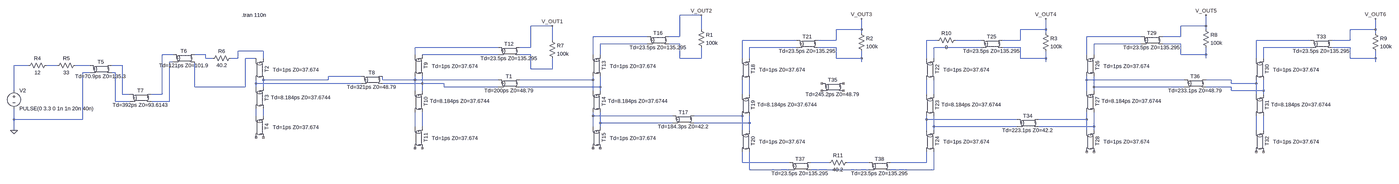
[diagram p0: schematic TDM_TransmissionLine.asc, whole sheet]
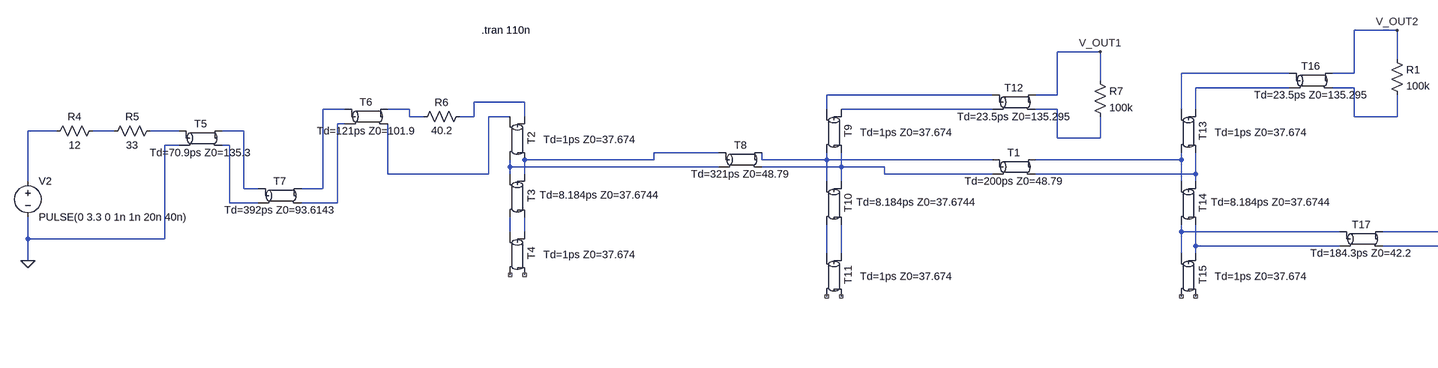
[diagram p1: schematic TDM_TransmissionLine.asc, part, row 1 of 1, column 1 of 2]
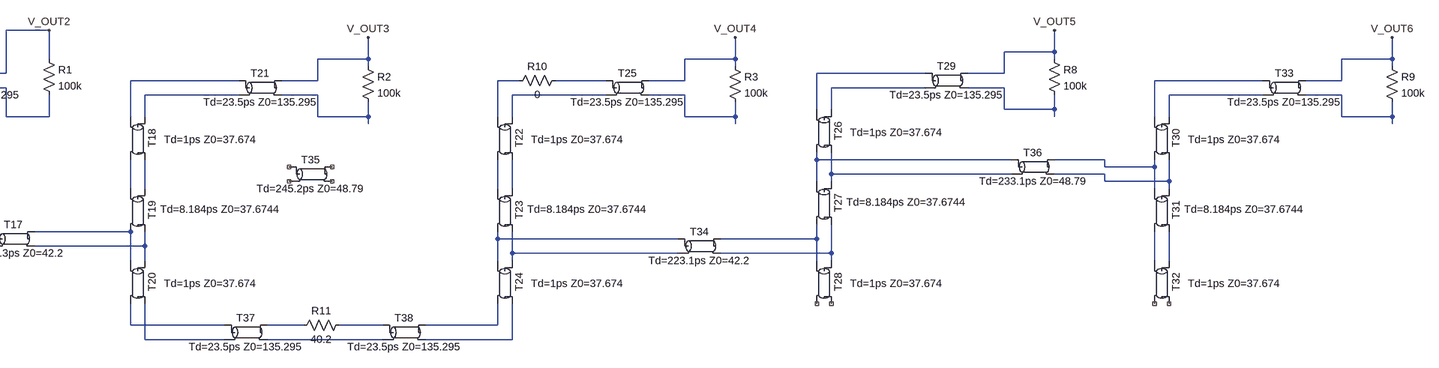
[diagram p2: schematic TDM_TransmissionLine.asc, part, row 1 of 1, column 2 of 2]
TDM_TransmissionLine.asc, the LTspice schematic file:
Version 4
SHEET 1 6036 992
WIRE 2448 272 2352 272
WIRE 1728 320 1632 320
WIRE 4864 320 4864 272
WIRE 4864 320 4752 320
WIRE 2448 336 2448 272
WIRE 3232 336 3232 288
WIRE 3232 336 3120 336
WIRE 4048 336 4048 288
WIRE 4048 336 3936 336
WIRE 4864 336 4864 320
WIRE 5648 336 5648 288
WIRE 5648 336 5536 336
WIRE 3232 352 3232 336
WIRE 4048 352 4048 336
WIRE 5648 352 5648 336
WIRE 2208 368 1968 368
WIRE 2352 368 2352 272
WIRE 2352 368 2304 368
WIRE 4576 368 4336 368
WIRE 4752 368 4752 320
WIRE 4752 368 4672 368
WIRE 1728 384 1728 320
WIRE 2944 384 2704 384
WIRE 3120 384 3120 336
WIRE 3120 384 3040 384
WIRE 3568 384 3520 384
WIRE 3760 384 3648 384
WIRE 3936 384 3936 336
WIRE 3936 384 3856 384
WIRE 5360 384 5120 384
WIRE 5536 384 5536 336
WIRE 5536 384 5456 384
WIRE 2208 400 2000 400
WIRE 2352 400 2304 400
WIRE 4576 400 4368 400
WIRE 4752 400 4672 400
WIRE 1488 416 1120 416
WIRE 1632 416 1632 320
WIRE 1632 416 1584 416
WIRE 2944 416 2736 416
WIRE 3120 416 3040 416
WIRE 3760 416 3552 416
WIRE 3936 416 3856 416
WIRE 5360 416 5152 416
WIRE 5536 416 5456 416
WIRE 448 432 336 432
WIRE 48 448 0 448
WIRE 192 448 144 448
WIRE 1120 448 1120 416
WIRE 1488 448 1152 448
WIRE 1632 448 1584 448
WIRE 1968 448 1968 368
WIRE 2000 448 2000 400
WIRE 4336 448 4336 368
WIRE 4368 448 4368 400
WIRE 4752 448 4752 400
WIRE 4864 448 4864 416
WIRE 4864 448 4752 448
WIRE 192 464 192 448
WIRE 224 464 192 464
WIRE 336 464 336 432
WIRE 336 464 304 464
WIRE 416 464 368 464
WIRE 448 464 448 432
WIRE 2352 464 2352 400
WIRE 2448 464 2448 416
WIRE 2448 464 2352 464
WIRE 2704 464 2704 384
WIRE 2736 464 2736 416
WIRE 3120 464 3120 416
WIRE 3232 464 3232 432
WIRE 3232 464 3120 464
WIRE 3520 464 3520 384
WIRE 3552 464 3552 416
WIRE 3936 464 3936 416
WIRE 4048 464 4048 432
WIRE 4048 464 3936 464
WIRE 4864 464 4864 448
WIRE 5120 464 5120 384
WIRE 5152 464 5152 416
WIRE 5536 464 5536 416
WIRE 5648 464 5648 432
WIRE 5648 464 5536 464
WIRE 48 480 32 480
WIRE 3232 480 3232 464
WIRE 4048 480 4048 464
WIRE 5648 480 5648 464
WIRE -592 496 -656 496
WIRE -464 496 -512 496
WIRE -320 496 -384 496
WIRE -176 496 -224 496
WIRE 1632 512 1632 448
WIRE 1728 512 1728 464
WIRE 1728 512 1632 512
WIRE -320 528 -352 528
WIRE -208 528 -224 528
WIRE 880 544 736 544
WIRE 736 560 736 544
WIRE 736 560 448 560
WIRE 976 560 976 544
WIRE 1120 560 1120 544
WIRE 1120 560 976 560
WIRE 1488 560 1120 560
WIRE 1968 560 1968 544
WIRE 1968 560 1584 560
WIRE 4336 560 4336 544
WIRE 4768 560 4336 560
WIRE 4976 560 4864 560
WIRE 416 576 416 560
WIRE 880 576 416 576
WIRE 1152 576 1152 544
WIRE 1152 576 976 576
WIRE 1248 576 1152 576
WIRE 4976 576 4976 560
WIRE 5120 576 5120 560
WIRE 5120 576 4976 576
WIRE 144 592 144 480
WIRE 368 592 368 464
WIRE 368 592 144 592
WIRE 416 592 416 576
WIRE 448 592 448 560
WIRE 1248 592 1248 576
WIRE 1488 592 1248 592
WIRE 2000 592 2000 544
WIRE 2000 592 1584 592
WIRE 4368 592 4368 544
WIRE 4768 592 4368 592
WIRE 4976 592 4864 592
WIRE -656 608 -656 496
WIRE 1120 608 1120 560
WIRE 1152 608 1152 576
WIRE 1968 608 1968 560
WIRE 2000 608 2000 592
WIRE 4336 608 4336 560
WIRE 4368 608 4368 592
WIRE 4976 608 4976 592
WIRE 5152 608 5152 560
WIRE 5152 608 4976 608
WIRE -176 624 -176 496
WIRE -144 624 -176 624
WIRE 0 624 0 448
WIRE 0 624 -48 624
WIRE 2704 624 2704 560
WIRE 2736 624 2736 560
WIRE 3520 624 3520 560
WIRE 3552 624 3552 560
WIRE 5120 624 5120 576
WIRE 5152 624 5152 608
WIRE -208 656 -208 528
WIRE -144 656 -208 656
WIRE 32 656 32 480
WIRE 32 656 -48 656
WIRE 416 720 416 688
WIRE 448 720 448 688
WIRE 1968 720 1968 704
WIRE 2320 720 1968 720
WIRE 2704 720 2416 720
WIRE -656 736 -656 688
WIRE -352 736 -352 528
WIRE -352 736 -656 736
WIRE 3520 736 3520 720
WIRE 3920 736 3520 736
WIRE 4336 736 4336 704
WIRE 4336 736 4016 736
WIRE 2000 752 2000 704
WIRE 2320 752 2000 752
WIRE 2736 752 2736 720
WIRE 2736 752 2416 752
WIRE 1120 768 1120 704
WIRE 1152 768 1152 704
WIRE 1968 768 1968 720
WIRE 2000 768 2000 752
WIRE 3552 768 3552 720
WIRE 3920 768 3552 768
WIRE 4368 768 4368 704
WIRE 4368 768 4016 768
WIRE -656 784 -656 736
WIRE 2704 784 2704 720
WIRE 2736 784 2736 752
WIRE 3520 784 3520 736
WIRE 3552 784 3552 768
WIRE 4336 784 4336 736
WIRE 4368 784 4368 768
WIRE 5120 784 5120 720
WIRE 5152 784 5152 720
WIRE 2704 928 2704 880
WIRE 2912 928 2704 928
WIRE 3088 928 3008 928
WIRE 3264 928 3168 928
WIRE 3520 928 3520 880
WIRE 3520 928 3360 928
WIRE 2736 960 2736 880
WIRE 2912 960 2736 960
WIRE 3264 960 3008 960
WIRE 3552 960 3552 880
WIRE 3552 960 3360 960
FLAG -656 784 0
FLAG 1728 320 V_OUT1
FLAG 2448 272 V_OUT2
FLAG 3232 288 V_OUT3
FLAG 4048 288 V_OUT4
FLAG 4864 272 V_OUT5
FLAG 5648 288 V_OUT6
SYMBOL tline 432 512 R90
WINDOW 3 19 -161 VBottom 2
SYMATTR Value Td=1ps Z0=37.674
SYMATTR InstName T2
SYMBOL tline 432 640 R90
WINDOW 3 14 -183 VBottom 2
SYMATTR Value Td=8.184ps Z0=37.6744
SYMATTR InstName T3
SYMBOL tline 432 768 R90
WINDOW 3 19 -161 VBottom 2
SYMATTR Value Td=1ps Z0=37.674
SYMATTR InstName T4
SYMBOL voltage -656 592 R0
WINDOW 123 0 0 Left 0
WINDOW 39 0 0 Left 0
SYMATTR InstName V2
SYMATTR Value PULSE(0 3.3 0 1n 1n 20n 40n)
SYMBOL res -496 480 R90
WINDOW 0 0 56 VBottom 2
WINDOW 3 32 56 VTop 2
SYMATTR InstName R4
SYMATTR Value 12
SYMBOL res -368 480 R90
WINDOW 0 0 56 VBottom 2
WINDOW 3 32 56 VTop 2
SYMATTR InstName R5
SYMATTR Value 33
SYMBOL tline -272 512 R0
SYMATTR InstName T5
SYMATTR Value Td=70.9ps Z0=135.3
SYMBOL tline 96 464 R0
SYMATTR InstName T6
SYMATTR Value Td=121ps Z0=101.9
SYMBOL tline -96 640 R0
SYMATTR InstName T7
SYMATTR Value Td=392ps Z0=93.6143
SYMBOL tline 928 560 R0
SYMATTR InstName T8
SYMATTR Value Td=321ps Z0=48.79
SYMBOL tline 1136 496 R90
WINDOW 3 19 -161 VBottom 2
SYMATTR Value Td=1ps Z0=37.674
SYMATTR InstName T9
SYMBOL tline 1136 656 R90
WINDOW 3 14 -183 VBottom 2
SYMATTR Value Td=8.184ps Z0=37.6744
SYMATTR InstName T10
SYMBOL tline 1136 816 R90
WINDOW 3 19 -161 VBottom 2
SYMATTR Value Td=1ps Z0=37.674
SYMATTR InstName T11
SYMBOL tline 1536 432 R0
SYMATTR InstName T12
SYMATTR Value Td=23.5ps Z0=135.295
SYMBOL res 1712 368 R0
SYMATTR InstName R7
SYMATTR Value 100k
SYMBOL tline 1536 576 R0
SYMATTR InstName T1
SYMATTR Value Td=200ps Z0=48.79
SYMBOL tline 1984 496 R90
WINDOW 3 19 -161 VBottom 2
SYMATTR Value Td=1ps Z0=37.674
SYMATTR InstName T13
SYMBOL tline 1984 656 R90
WINDOW 3 14 -183 VBottom 2
SYMATTR Value Td=8.184ps Z0=37.6744
SYMATTR InstName T14
SYMBOL tline 1984 816 R90
WINDOW 3 19 -161 VBottom 2
SYMATTR Value Td=1ps Z0=37.674
SYMATTR InstName T15
SYMBOL tline 2256 384 R0
SYMATTR InstName T16
SYMATTR Value Td=23.5ps Z0=135.295
SYMBOL res 2432 320 R0
SYMATTR InstName R1
SYMATTR Value 100k
SYMBOL tline 2368 736 R0
SYMATTR InstName T17
SYMATTR Value Td=184.3ps Z0=42.2
SYMBOL tline 2720 512 R90
WINDOW 3 19 -161 VBottom 2
SYMATTR Value Td=1ps Z0=37.674
SYMATTR InstName T18
SYMBOL tline 2720 672 R90
WINDOW 3 14 -183 VBottom 2
SYMATTR Value Td=8.184ps Z0=37.6744
SYMATTR InstName T19
SYMBOL tline 2720 832 R90
WINDOW 3 19 -161 VBottom 2
SYMATTR Value Td=1ps Z0=37.674
SYMATTR InstName T20
SYMBOL tline 2992 400 R0
SYMATTR InstName T21
SYMATTR Value Td=23.5ps Z0=135.295
SYMBOL res 3216 336 R0
SYMATTR InstName R2
SYMATTR Value 100k
SYMBOL tline 3536 512 R90
WINDOW 3 19 -161 VBottom 2
SYMATTR Value Td=1ps Z0=37.674
SYMATTR InstName T22
SYMBOL tline 3536 672 R90
WINDOW 3 14 -183 VBottom 2
SYMATTR Value Td=8.184ps Z0=37.6744
SYMATTR InstName T23
SYMBOL tline 3536 832 R90
WINDOW 3 19 -161 VBottom 2
SYMATTR Value Td=1ps Z0=37.674
SYMATTR InstName T24
SYMBOL tline 3808 400 R0
SYMATTR InstName T25
SYMATTR Value Td=23.5ps Z0=135.295
SYMBOL res 4032 336 R0
SYMATTR InstName R3
SYMATTR Value 100k
SYMBOL tline 4352 496 R90
WINDOW 3 19 -161 VBottom 2
SYMATTR Value Td=1ps Z0=37.674
SYMATTR InstName T26
SYMBOL tline 4352 656 R90
WINDOW 3 14 -183 VBottom 2
SYMATTR Value Td=8.184ps Z0=37.6744
SYMATTR InstName T27
SYMBOL tline 4352 832 R90
WINDOW 3 19 -161 VBottom 2
SYMATTR Value Td=1ps Z0=37.674
SYMATTR InstName T28
SYMBOL tline 4624 384 R0
SYMATTR InstName T29
SYMATTR Value Td=23.5ps Z0=135.295
SYMBOL res 4848 320 R0
SYMATTR InstName R8
SYMATTR Value 100k
SYMBOL tline 5136 512 R90
WINDOW 3 19 -161 VBottom 2
SYMATTR Value Td=1ps Z0=37.674
SYMATTR InstName T30
SYMBOL tline 5136 672 R90
WINDOW 3 14 -183 VBottom 2
SYMATTR Value Td=8.184ps Z0=37.6744
SYMATTR InstName T31
SYMBOL tline 5136 832 R90
WINDOW 3 19 -161 VBottom 2
SYMATTR Value Td=1ps Z0=37.674
SYMATTR InstName T32
SYMBOL tline 5408 400 R0
SYMATTR InstName T33
SYMATTR Value Td=23.5ps Z0=135.295
SYMBOL res 5632 336 R0
SYMATTR InstName R9
SYMATTR Value 100k
SYMBOL tline 3968 752 R0
SYMATTR InstName T34
SYMATTR Value Td=223.1ps Z0=42.2
SYMBOL tline 3104 592 R0
SYMATTR InstName T35
SYMATTR Value Td=245.2ps Z0=48.79
SYMBOL tline 4816 576 R0
SYMATTR InstName T36
SYMATTR Value Td=233.1ps Z0=48.79
SYMBOL res 3664 368 R90
WINDOW 0 0 56 VBottom 2
WINDOW 3 32 56 VTop 2
SYMATTR InstName R10
SYMATTR Value 0
SYMBOL tline 2960 944 R0
SYMATTR InstName T37
SYMATTR Value Td=23.5ps Z0=135.295
SYMBOL tline 3312 944 R0
SYMATTR InstName T38
SYMATTR Value Td=23.5ps Z0=135.295
SYMBOL res 3184 912 R90
WINDOW 0 0 56 VBottom 2
WINDOW 3 32 56 VTop 2
SYMATTR InstName R11
SYMATTR Value 40.2
SYMBOL res 320 448 R90
WINDOW 0 0 56 VBottom 2
WINDOW 3 32 56 VTop 2
SYMATTR InstName R6
SYMATTR Value 40.2
TEXT 352 272 Left 2 !.tran 110n

The netlist it stands for:
* TDM_TransmissionLine.asc
T2 N018 N023 N030 N035 Td=1ps Z0=37.674
T3 N030 N035 N045 N044 Td=8.184ps Z0=37.6744
T4 N045 N044 NC_01 NC_02 Td=1ps Z0=37.674
V2 N025 0 PULSE(0 3.3 0 1n 1n 20n 40n)
R4 N026 N025 12
R5 N027 N026 33
T5 N027 0 N028 N029 Td=70.9ps Z0=135.3
T6 N019 N024 N020 N023 Td=121ps Z0=101.9
T7 N028 N029 N019 N024 Td=392ps Z0=93.6143
T8 N030 N035 N031 N036 Td=321ps Z0=48.79
T9 N021 N011 N036 N031 Td=1ps Z0=37.674
T10 N036 N031 N053 N052 Td=8.184ps Z0=37.6744
T11 N053 N052 NC_03 NC_04 Td=1ps Z0=37.674
T12 N011 N021 V_OUT1 N022 Td=23.5ps Z0=135.295
R7 V_OUT1 N022 100k
T1 N031 N036 N032 N037 Td=200ps Z0=48.79
T13 N007 N001 N037 N032 Td=1ps Z0=37.674
T14 N037 N032 N050 N046 Td=8.184ps Z0=37.6744
T15 N050 N046 NC_05 NC_06 Td=1ps Z0=37.674
T16 N001 N007 V_OUT2 N008 Td=23.5ps Z0=135.295
R1 V_OUT2 N008 100k
T17 N046 N050 N047 N051 Td=184.3ps Z0=42.2
T18 N012 N003 N041 N040 Td=1ps Z0=37.674
T19 N041 N040 N051 N047 Td=8.184ps Z0=37.6744
T20 N051 N047 N062 N058 Td=1ps Z0=37.674
T21 N003 N012 V_OUT3 N013 Td=23.5ps Z0=135.295
R2 V_OUT3 N013 100k
T22 N014 N004 N043 N042 Td=1ps Z0=37.674
T23 N043 N042 N054 N048 Td=8.184ps Z0=37.6744
T24 N054 N048 N064 N061 Td=1ps Z0=37.674
T25 N005 N014 V_OUT4 N015 Td=23.5ps Z0=135.295
R3 V_OUT4 N015 100k
T26 N009 N002 N038 N033 Td=1ps Z0=37.674
T27 N038 N033 N055 N049 Td=8.184ps Z0=37.6744
T28 N055 N049 NC_07 NC_08 Td=1ps Z0=37.674
T29 N002 N009 V_OUT5 N010 Td=23.5ps Z0=135.295
R8 V_OUT5 N010 100k
T30 N016 N006 N039 N034 Td=1ps Z0=37.674
T31 N039 N034 N057 N056 Td=8.184ps Z0=37.6744
T32 N057 N056 NC_09 NC_10 Td=1ps Z0=37.674
T33 N006 N016 V_OUT6 N017 Td=23.5ps Z0=135.295
R9 V_OUT6 N017 100k
T34 N048 N054 N049 N055 Td=223.1ps Z0=42.2
T35 NC_11 NC_12 NC_13 NC_14 Td=245.2ps Z0=48.79
T36 N033 N038 N034 N039 Td=233.1ps Z0=48.79
R10 N005 N004 0
T37 N058 N062 N059 N063 Td=23.5ps Z0=135.295
T38 N060 N063 N061 N064 Td=23.5ps Z0=135.295
R11 N060 N059 40.2
R6 N018 N020 40.2
.tran 110n
.backanno
.end